# Altium schematic sheet Conncetors.SchDoc
size A3
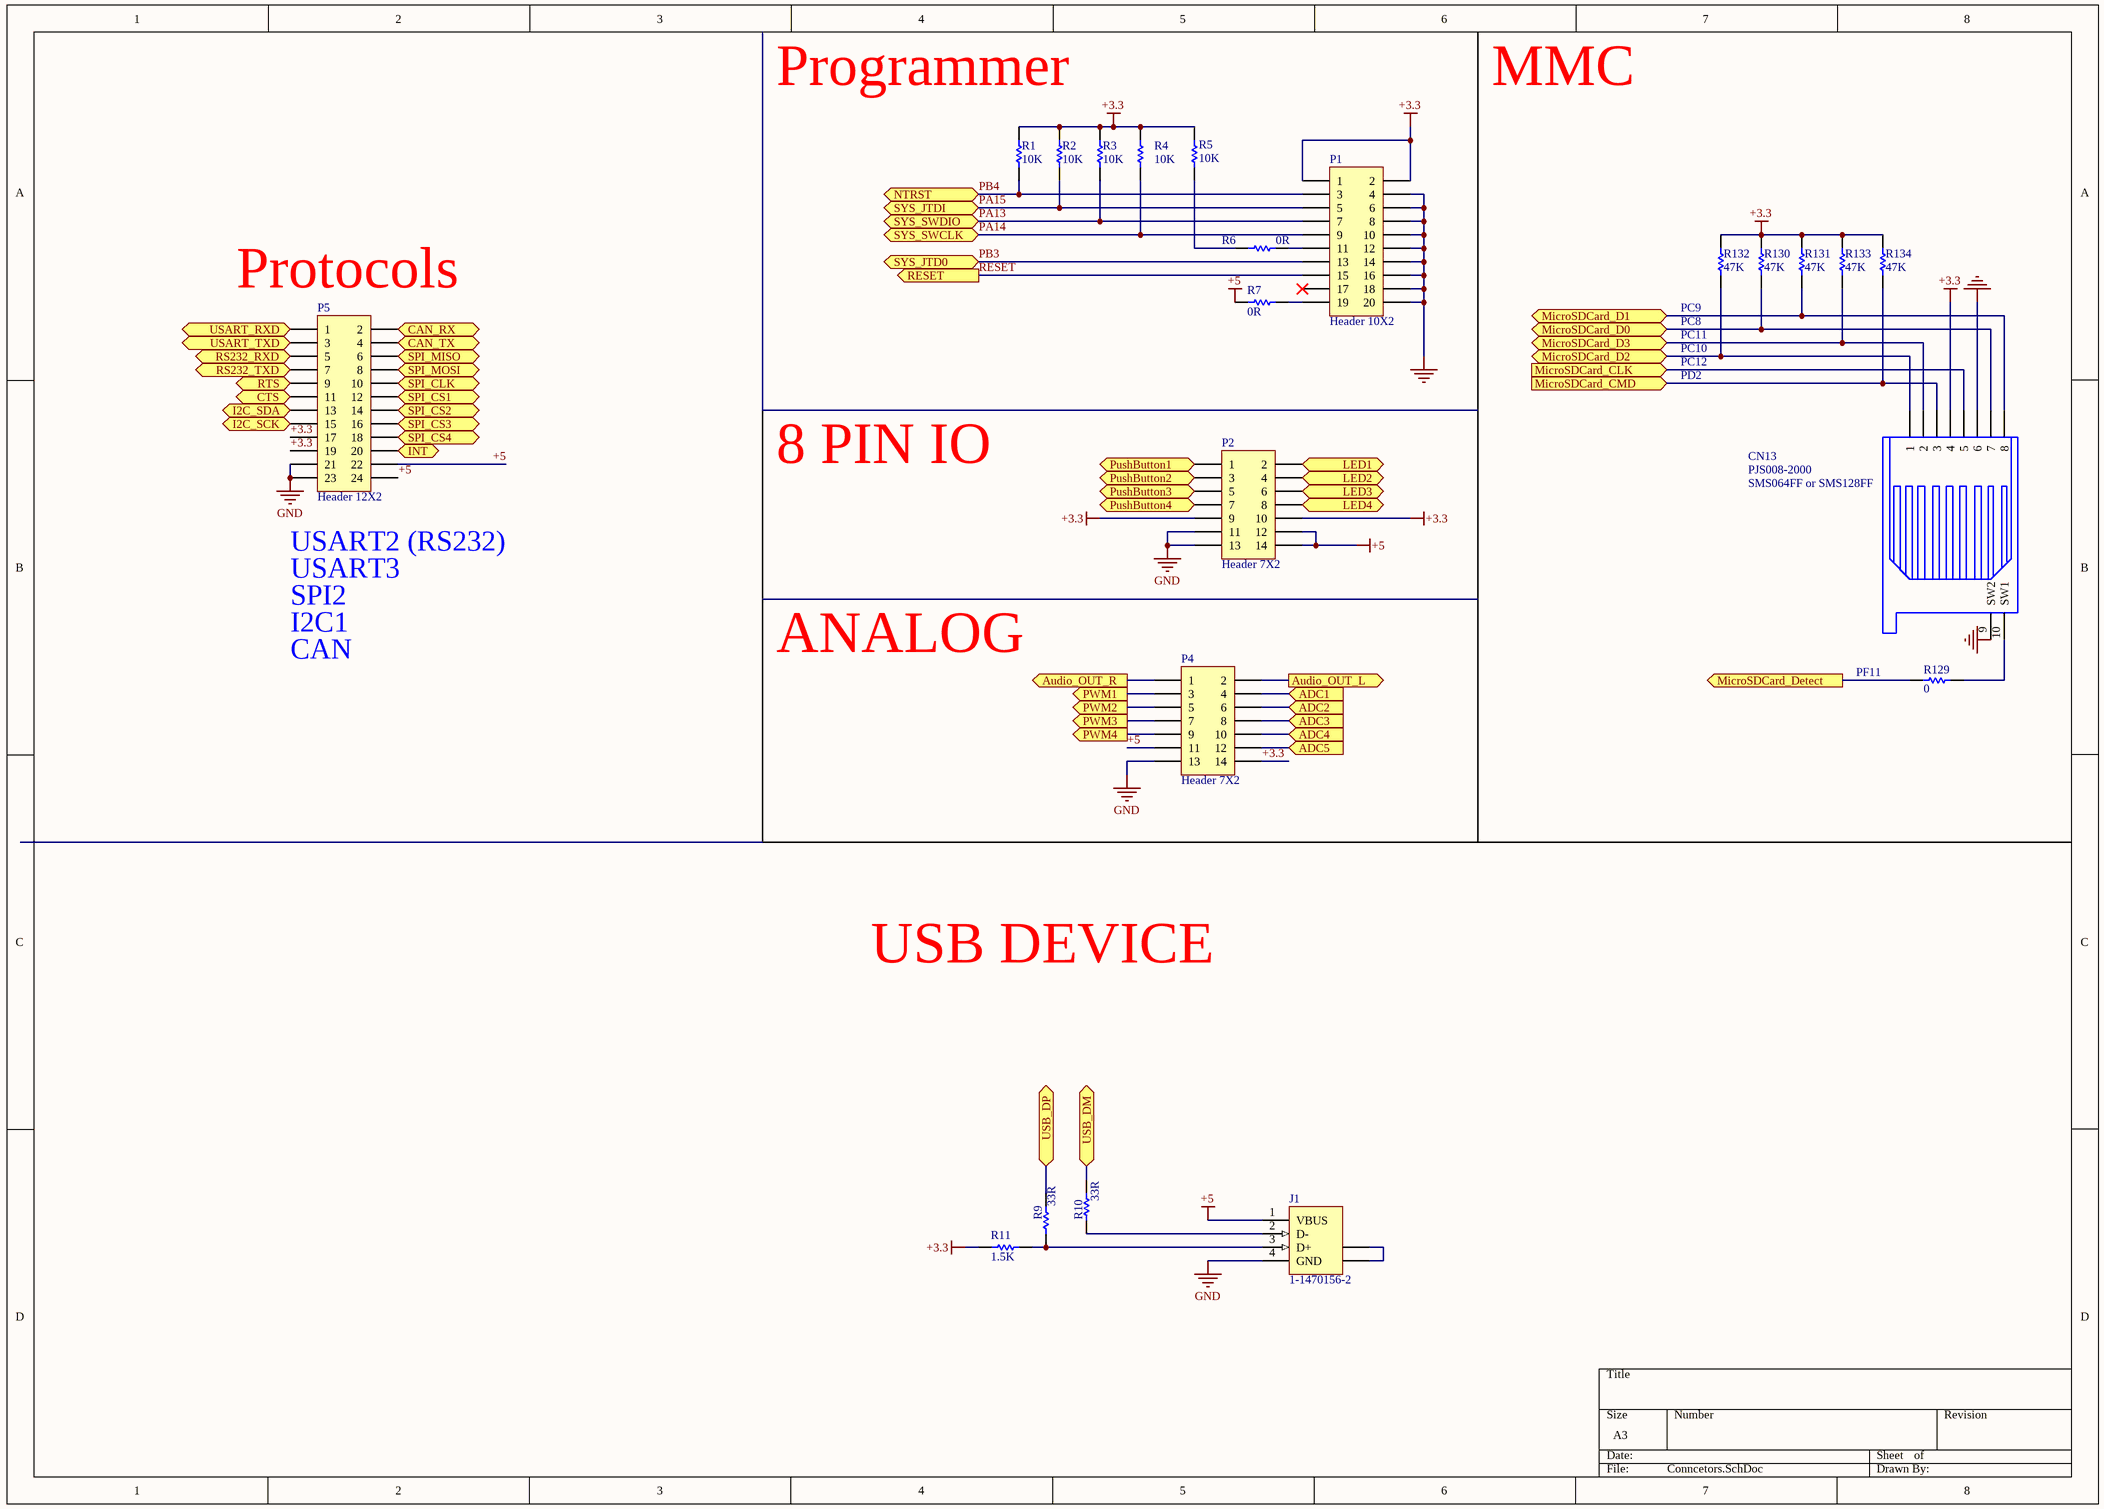
[diagram p0: Conncetors.SchDoc]

## Parts
CN13  PJS008-2000  [MicroSD_1]
J1  1-1470156-2  [440247]
P1  Header 10X2  [IDC20S]
P2  Header 7X2  [IDC14S]
P4  Header 7X2  [IDC14S]
P5  Header 12X2  [IDC24S]
R1  10K  [1206]
R2  10K  [1206]
R3  10K  [1206]
R4  10K  [1206]
R5  10K  [1206]
R6  0R  [1206]
R7  0R  [1206]
R9  33R  [1206]
R10  33R  [1206]
R11  1.5K  [1206]
R129  0  [R1206]
R130  47K  [R1206]
R131  47K  [R1206]
R132  47K  [R1206]
R133  47K  [R1206]
R134  47K  [R1206]

## Ports
ADC1 (in), ADC2 (in), ADC3 (in), ADC4 (in), ADC5 (in), Audio_OUT_L (out), Audio_OUT_R (out), CAN_RX (in), CAN_TX (out), CTS (in), I2C_SCK (bidir), I2C_SDA (bidir), INT (out), LED1 (bidir), LED2 (bidir), LED3 (bidir), LED4 (bidir), MicroSDCard_CLK (in), MicroSDCard_CMD (in), MicroSDCard_D0 (bidir), MicroSDCard_D1 (bidir), MicroSDCard_D2 (bidir), MicroSDCard_D3 (bidir), MicroSDCard_Detect (out), NTRST (bidir), PushButton1 (bidir), PushButton2 (bidir), PushButton3 (bidir), PushButton4 (bidir), PWM1 (out), PWM2 (out), PWM3 (out), PWM4 (out), RESET (out), RS232_RXD (in), RS232_TXD (out), RTS (out), SPI_CLK (in), SPI_CS1 (in), SPI_CS2 (in), SPI_CS3 (in), SPI_CS4 (in), SPI_MISO (out), SPI_MOSI (in), SYS_JTD0 (bidir), SYS_JTDI (bidir), SYS_SWCLK (bidir), SYS_SWDIO (bidir), USART_RXD (in), USART_TXD (out), USB_DM (bidir), USB_DP (bidir)

## Nets
+3.3: CN13.4 P1.1 P1.2 P2.9 P2.10 P4.14 P5.17 P5.19 R1.2 R2.2 R3.2 R4.2 R5.2 R11.1 R130.1 R131.1 R132.1 R133.1 R134.1
+5: J1.1(VBUS) P2.12 P2.14 P4.11 P5.22 P5.24 R7.2
GND: CN13.6 CN13.9(SW2) J1.4(GND) P1.4 P1.6 P1.8 P1.10 P1.12 P1.14 P1.16 P1.18 P1.20 P2.11 P2.13 P4.13 P5.21 P5.23
ADC1: P4.4 ; port ADC1
ADC2: P4.6 ; port ADC2
ADC3: P4.8 ; port ADC3
ADC4: P4.10 ; port ADC4
ADC5: P4.12 ; port ADC5
Audio_OUT_L: P4.2 ; port Audio_OUT_L
Audio_OUT_R: P4.1 ; port Audio_OUT_R
CAN_RX: P5.2 ; port CAN_RX
CAN_TX: P5.4 ; port CAN_TX
CTS: P5.11 ; port CTS
I2C_SCK: P5.15 ; port I2C_SCK
I2C_SDA: P5.13 ; port I2C_SDA
INT: P5.20 ; port INT
LED1: P2.2 ; port LED1
LED2: P2.4 ; port LED2
LED3: P2.6 ; port LED3
LED4: P2.8 ; port LED4
MicroSDCard_CLK: CN13.5 ; port MicroSDCard_CLK
MicroSDCard_CMD: CN13.3 R134.2 ; port MicroSDCard_CMD
MicroSDCard_D0: CN13.7 R130.2 ; port MicroSDCard_D0
MicroSDCard_D1: CN13.8 R131.2 ; port MicroSDCard_D1
MicroSDCard_D2: CN13.1 R132.2 ; port MicroSDCard_D2
MicroSDCard_D3: CN13.2 R133.2 ; port MicroSDCard_D3
MicroSDCard_Detect: R129.1 ; port MicroSDCard_Detect
PA13: P1.7 R3.1 ; port SYS_SWDIO
PA14: P1.9 R4.1 ; port SYS_SWCLK
PA15: P1.5 R2.1 ; port SYS_JTDI
PB3: P1.13 ; port SYS_JTD0
PB4: P1.3 R1.1 ; port NTRST
PushButton1: P2.1 ; port PushButton1
PushButton2: P2.3 ; port PushButton2
PushButton3: P2.5 ; port PushButton3
PushButton4: P2.7 ; port PushButton4
PWM1: P4.3 ; port PWM1
PWM2: P4.5 ; port PWM2
PWM3: P4.7 ; port PWM3
PWM4: P4.9 ; port PWM4
RESET: P1.15 ; port RESET
RS232_RXD: P5.5 ; port RS232_RXD
RS232_TXD: P5.7 ; port RS232_TXD
RTS: P5.9 ; port RTS
SPI_CLK: P5.10 ; port SPI_CLK
SPI_CS1: P5.12 ; port SPI_CS1
SPI_CS2: P5.14 ; port SPI_CS2
SPI_CS3: P5.16 ; port SPI_CS3
SPI_CS4: P5.18 ; port SPI_CS4
SPI_MISO: P5.6 ; port SPI_MISO
SPI_MOSI: P5.8 ; port SPI_MOSI
USART_RXD: P5.1 ; port USART_RXD
USART_TXD: P5.3 ; port USART_TXD
USB_DM: R10.1 ; port USB_DM
USB_DP: R9.1 ; port USB_DP
NetCN13_10: CN13.10(SW1) R129.2
NetJ1_2: J1.2(D-) R10.2
NetJ1_3: J1.3(D+) R9.2 R11.2
NetJ1_5: J1.5(SHLD) J1.6(SHLD)
NetP1_11: P1.11 R6.1
NetP1_19: P1.19 R7.1
NetR5_1: R5.1 R6.2

Not connected (* = marked no-connect by the designer): P1 17*

## Notes on the sheet
- Programmer
- MMC
- (near P5) Protocols
- (near R132) PC9
- (near R132) PC8
- PC10
- PC11
- PD2
- PC12
- 8 PIN IO
- (near CN13) SMS064FF or SMS128FF
- USART3
- (near P5) USART2 (RS232)
- SPI2
- I2C1
- CAN
- ANALOG
- PF11
- USB DEVICE

## Library data of the parts
CN13 = SMS016AFA5E
J1 = 1-1470156-2: USB 1.1, Right Angle, Thru-Hole, B Type, Receptacle, 4 Position, Black; ContactMaterial: Phosphor Bronze; ContactPlating: Gold over Nickel; TerminationLength: 3.00mm [0.118in.]; PCB_Layout: Complies with manufacturer's recommendation.; DrillSize: Corresponds to nominal value.; PanelGround: Without; Published: 15-Jul-2004; DatasheetDocument: 02-Jun-2001; PackageDocument: 02-Jun-2001; PackageReference: 1-1470156; Publisher: Altium Limited; HousingMaterial: Glass-Filled Thermoplastic; ComponentLink1Description: Manufacturer Link; ComponentLink1URL: http://www.tycoelectronics.com/; ComponentLink2Description: Packaging Specification; ComponentLink2URL: http://ecommas.tycoelectronics.com/commerce/DocumentDelivery/DDEController?Action=showdoc&DocId=Customer+Drawing%7F1470156%7FO%7Ftif%7FEnglish%7FC_1470156_O.tif
P1 = Header 10X2: Header, 10-Pin, Dual row; LatestRevisionDate: 17-Jul-2002; LatestRevisionNote: Re-released for DXP Platform.; Publisher: Altium Limited
P2 P4 = Header 7X2: Header, 7-Pin, Dual row; LatestRevisionDate: 17-Jul-2002; LatestRevisionNote: Re-released for DXP Platform.; Publisher: Altium Limited
P5 = Header 12X2: Header, 12-Pin, Dual row; LatestRevisionDate: 17-Jul-2002; LatestRevisionNote: Re-released for DXP Platform.; Publisher: Altium Limited
R1-R7 R129-R134 = Res1: Resistor; Value: 1K; Published: 8-Jun-2000; Revision: July-2002: Re-released for DXP Platform.; Publisher: Altium Limited
R9-R11 = Res1: Resistor; Value: 10K; Published: 8-Jun-2000; LatestRevisionDate: 17-Jul-2002; LatestRevisionNote: Re-released for DXP Platform.; PackageReference: AXIAL-0.3; Publisher: Altium Limited; PackageDescription: Axial Device, Thru-Hole; 2 Leads; 0.3 in Pin Spacing